# EAGLE schematic on_off_latch (EAGLE 8.6.0)
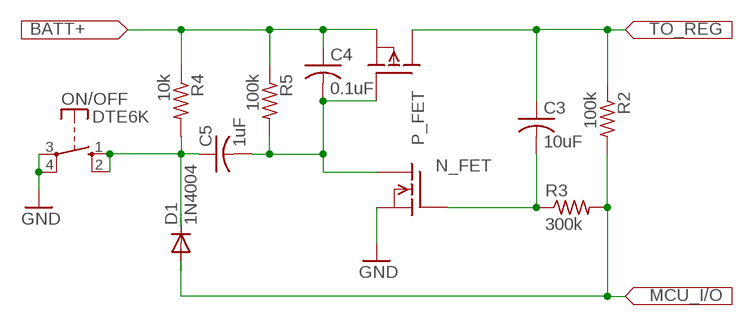
[diagram p0: schematic, sheet 1]

## Parts
C3  10uF  C-US050-024X044  [C050-024X044]
C4  0.1uF  C-US050-024X044  [C050-024X044]
C5  1uF  C-US050-024X044  [C050-024X044]
D1  1N4004  [DO41-10]
N_FET  BSS101  [TO92]
ON/OFF  DTE6K  [DTE6K]
P_FET  BSS92  [TO92]
R2  100k  R-US_R0805  [R0805]
R3  300k  R-US_R0805  [R0805]
R4  10k  R-US_R0805  [R0805]
R5  100k  R-US_R0805  [R0805]

## Nets
GND: N_FET.1(S) ON/OFF.3(P) ON/OFF.4(P)
N$1: C3.1 P_FET.2(D) R2.1
N$3: C4.2 C5.2 N_FET.3(D) P_FET.1(G) R5.2
N$5: C5.1 D1.C ON/OFF.1(S) ON/OFF.2(S) R4.2
N$6: C3.2 N_FET.2(G) R3.1
N$7: D1.A R2.2 R3.2
N$9: C4.1 P_FET.3(S) R4.1 R5.1

## Library data of the parts
C3-C5 = rcl:C-US: CAPACITOR, American symbol; SPICEPREFIX: C
D1 = diode:1N4004: DIODE general purpose rectifier, 1 A
N_FET = transistor-fet:BSS101: N-Channel Enhancement MOSFET 200V; 0,16A; 11Ohm
ON/OFF = switch-misc:DT: ITT SWITCH
P_FET = transistor-fet:BSS92: P-Channel Enhancement MOSFET -200V; -0,15A; 11Ohm
R2-R5 = rcl:R-US_: RESISTOR, American symbol; SPICEPREFIX: R